# EAGLE schematic picoslidertoy (EAGLE 9.6.2)
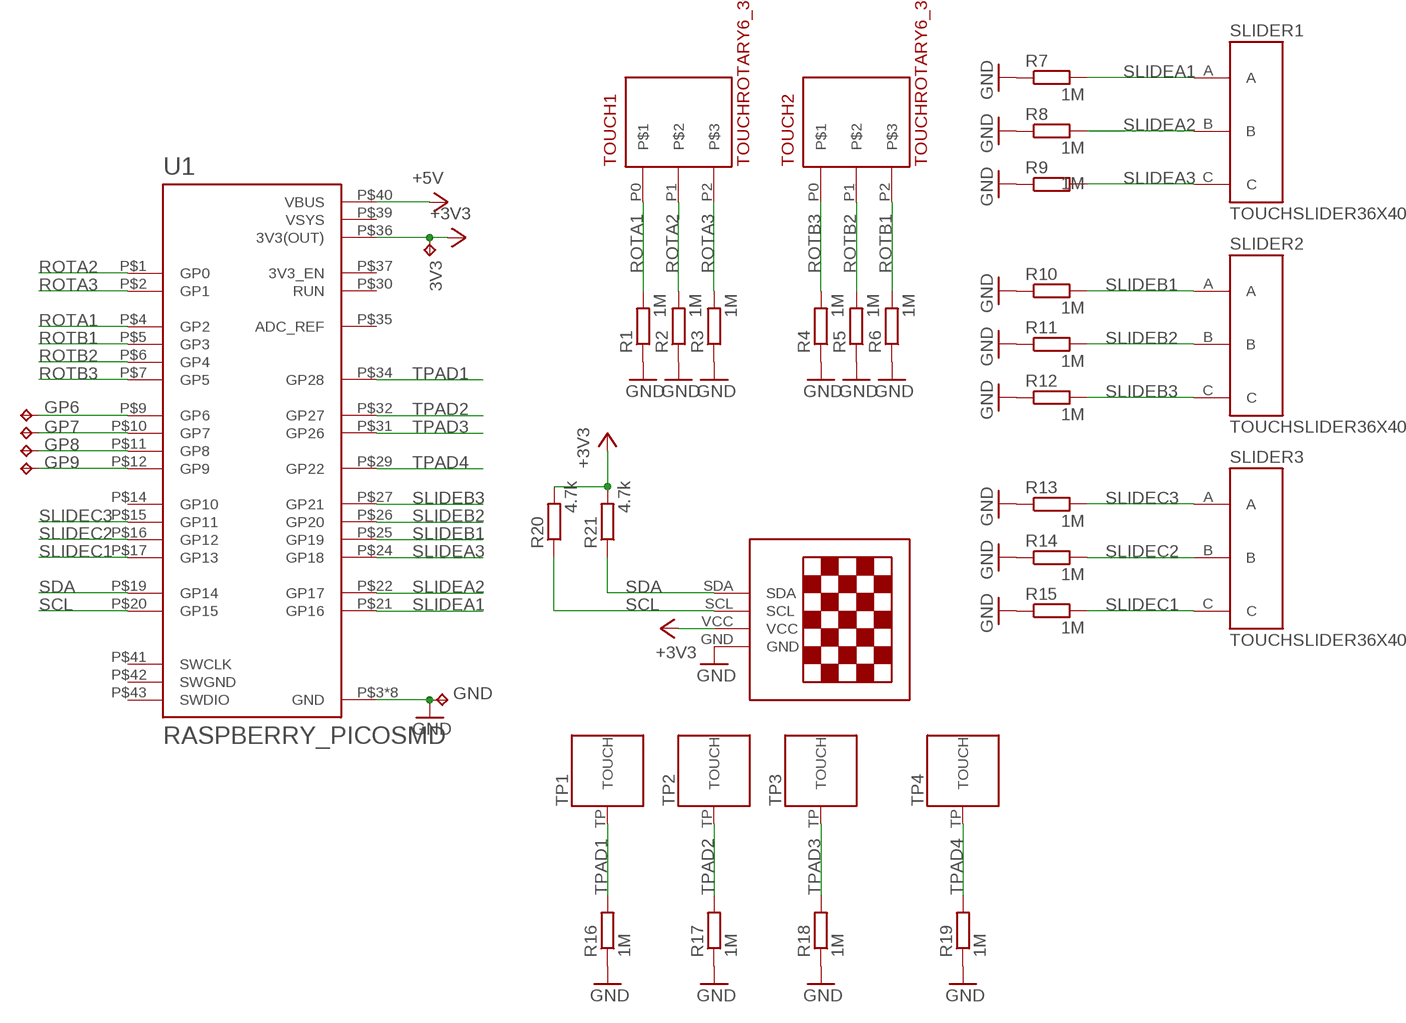
[diagram p0: schematic, sheet 1]

## Parts
3V3  TPTP20R  [TP20R]
GND  TPTP20R  [TP20R]
GP6  TPTP20R  [TP20R]
GP7  TPTP20R  [TP20R]
GP8  TPTP20R  [TP20R]
GP9  TPTP20R  [TP20R]
R1  1M  R-EU_R0805  [R0805]
R2  1M  R-EU_R0805  [R0805]
R3  1M  R-EU_R0805  [R0805]
R4  1M  R-EU_R0805  [R0805]
R5  1M  R-EU_R0805  [R0805]
R6  1M  R-EU_R0805  [R0805]
R7  1M  R-EU_R0805  [R0805]
R8  1M  R-EU_R0805  [R0805]
R9  1M  R-EU_R0805  [R0805]
R10  1M  R-EU_R0805  [R0805]
R11  1M  R-EU_R0805  [R0805]
R12  1M  R-EU_R0805  [R0805]
R13  1M  R-EU_R0805  [R0805]
R14  1M  R-EU_R0805  [R0805]
R15  1M  R-EU_R0805  [R0805]
R16  1M  R-EU_R0805  [R0805]
R17  1M  R-EU_R0805  [R0805]
R18  1M  R-EU_R0805  [R0805]
R19  1M  R-EU_R0805  [R0805]
R20  4.7k  R-EU_R0805  [R0805]
R21  4.7k  R-EU_R0805  [R0805]
SLIDER1  TOUCHSLIDER36X40  [TOUCHSLIDER3_6X40]
SLIDER2  TOUCHSLIDER36X40  [TOUCHSLIDER3_6X40]
SLIDER3  TOUCHSLIDER36X40  [TOUCHSLIDER3_6X40]
SMDBACK2  13"OLEDSMDONLY  [1.3"OLED_SMDBACKONLY]
TOUCH1  TOUCHROTARY6_30  [TOUCHROTARY1B]
TOUCH2  TOUCHROTARY6_30  [TOUCHROTARY1B]
TP1  TOUCHPADA  [TOUCHPADA_0.5IN]
TP2  TOUCHPADA  [TOUCHPADA_0.5IN]
TP3  TOUCHPADA  [TOUCHPADA_0.5IN]
TP4  TOUCHPADA  [TOUCHPADA_0.5IN]
U1  RASPBERRY_PICOSMD  [PICO-PKG-SMD]

## Nets
+3V3: 3V3.TP R20.2 R21.2 SMDBACK2.VCC U1.P$36(3V3(OUT))
+5V: U1.P$40(VBUS)
GND: GND.TP R1.1 R2.1 R3.1 R4.1 R5.1 R6.1 R7.1 R8.1 R9.1 R10.1 R11.1 R12.1 R13.1 R14.1 R15.1 R16.1 R17.1 R18.1 R19.1 SMDBACK2.GND U1.P$3(GND) U1.P$8(GND) U1.P$13(GND) U1.P$18(GND) U1.P$23(GND) U1.P$28(GND) U1.P$33(GND) U1.P$38(GND)
N$1: GP6.TP U1.P$9(GP6)
N$2: GP7.TP U1.P$10(GP7)
N$3: GP9.TP U1.P$12(GP9)
N$4: GP8.TP U1.P$11(GP8)
ROTA1: R1.2 TOUCH1.P0 U1.P$4(GP2)
ROTA2: R2.2 TOUCH1.P1 U1.P$1(GP0)
ROTA3: R3.2 TOUCH1.P2 U1.P$2(GP1)
ROTB1: R6.2 TOUCH2.P2 U1.P$5(GP3)
ROTB2: R5.2 TOUCH2.P1 U1.P$6(GP4)
ROTB3: R4.2 TOUCH2.P0 U1.P$7(GP5)
SCL: R20.1 SMDBACK2.SCL U1.P$20(GP15)
SDA: R21.1 SMDBACK2.SDA U1.P$19(GP14)
SLIDEA1: R7.2 SLIDER1.A U1.P$21(GP16)
SLIDEA2: R8.2 SLIDER1.B U1.P$22(GP17)
SLIDEA3: R9.2 SLIDER1.C U1.P$24(GP18)
SLIDEB1: R10.2 SLIDER2.A U1.P$25(GP19)
SLIDEB2: R11.2 SLIDER2.B U1.P$26(GP20)
SLIDEB3: R12.2 SLIDER2.C U1.P$27(GP21)
SLIDEC1: R15.2 SLIDER3.C U1.P$17(GP13)
SLIDEC2: R14.2 SLIDER3.B U1.P$16(GP12)
SLIDEC3: R13.2 SLIDER3.A U1.P$15(GP11)
TPAD1: R16.2 TP1.TP(TOUCH) U1.P$34(GP28)
TPAD2: R17.2 TP2.TP(TOUCH) U1.P$32(GP27)
TPAD3: R18.2 TP3.TP(TOUCH) U1.P$31(GP26)
TPAD4: R19.2 TP4.TP(TOUCH) U1.P$29(GP22)
Unconnected: U1.P$14(GP10) U1.P$30(RUN) U1.P$35(ADC_REF) U1.P$37(3V3_EN) U1.P$41(SWCLK) U1.P$43(SWDIO)

## Power pins joined to a net without a drawn wire
SWGND: U1.P$42(SWGND)
VSYS: U1.P$39(VSYS)

## Library data of the parts
3V3 GND GP6-GP9 = testpad:TP: Test pad
R1-R21 = rcl:R-EU_: RESISTOR, European symbol; SPICEPREFIX: R
SLIDER1-SLIDER3 = todstuff2023:TOUCHSLIDER3
SMDBACK2 = 13oled:13"OLED
TOUCH1 TOUCH2 = todstuff2023:TOUCHROTARY
TP1-TP4 = todstuff2023:TOUCHPAD
U1 = RpiPico:RASPBERRY_PICO: Raspberry Pi Pico